# Altium project DATN_PCB_Project.PrjPCB
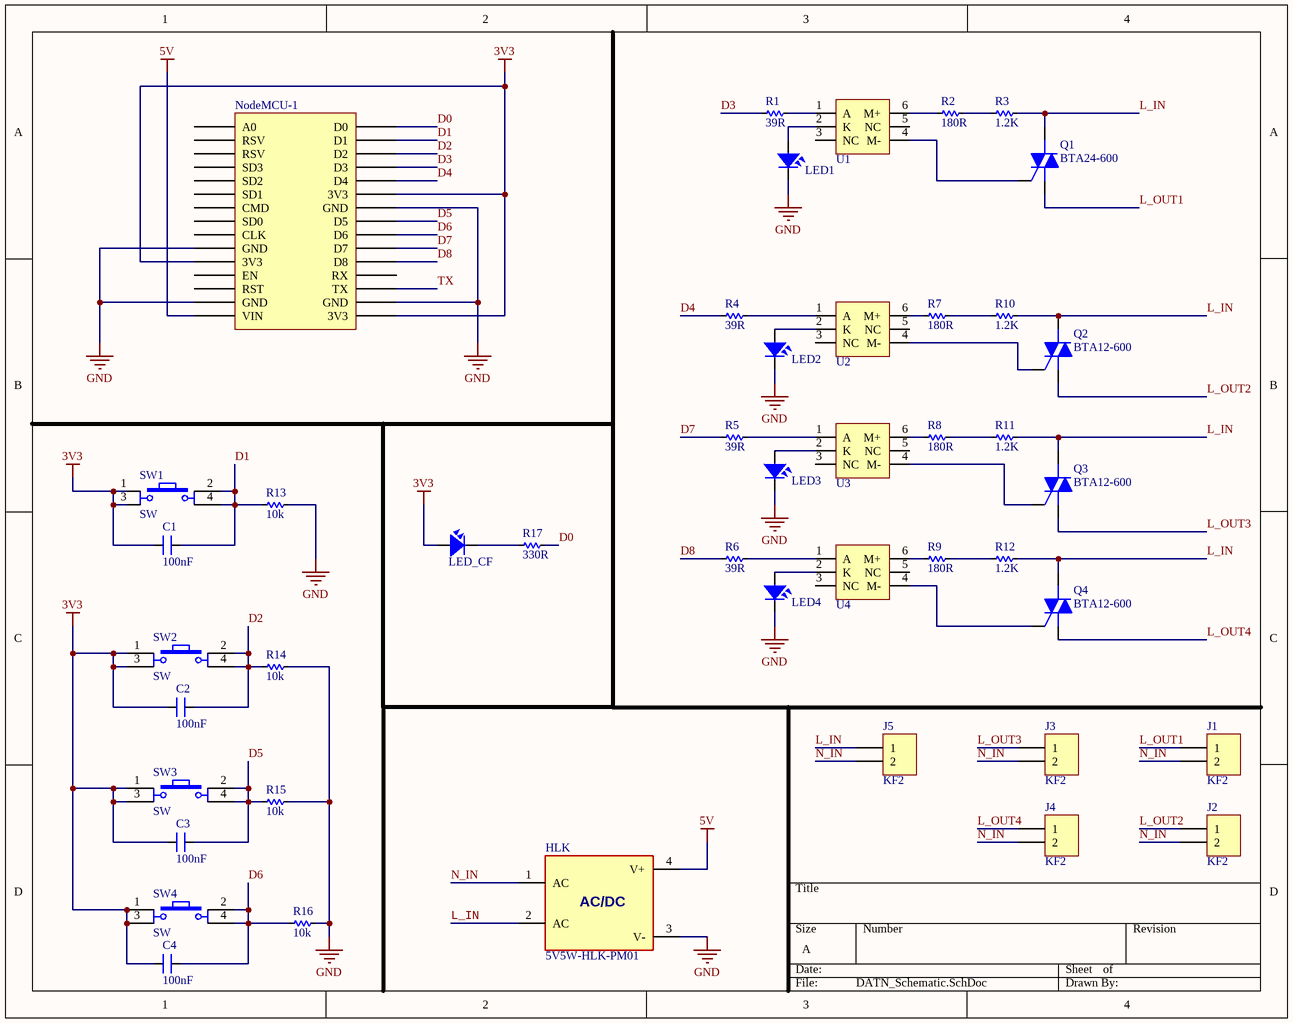
[diagram p0: DATN_Schematic.SchDoc]
1 sheet, 45 parts. Net scope: global (net labels, ports and power ports of the same name join across sheets).
Board file: PCB2.PcbDoc

## Sheet DATN_Schematic.SchDoc
size A

### Parts
C1  100nF  [CN1.5]
C2  100nF  [CN1.5]
C3  100nF  [CN1.5]
C4  100nF  [CN1.5]
HLK  5V5W-HLK-PM01  [HLK_PM01 5V3W]
J1  KF2  [KF2-5.08]
J2  KF2  [KF2-5.08]
J3  KF2  [KF2-5.08]
J4  KF2  [KF2-5.08]
J5  KF2  [KF2-5.08]
LED1  LED  [LED-5-RED]  (value not drawn)
LED2  LED  [LED-5-RED]  (value not drawn)
LED3  LED  [LED-5-RED]  (value not drawn)
LED4  LED  [LED-5-RED]  (value not drawn)
LED_CF  LED  [LED-5MM-BLUE]  (value not drawn)
NodeMCU-1  NodeMCU V1.0 ESP-12E  [NodeMCU V1.0 ESP-12E]  (value not drawn)
Q1  BTA24-600  [TO220H1]
Q2  BTA12-600  [TO220H1]
Q3  BTA12-600  [TO220H1]
Q4  BTA12-600  [TO220H1]
R1  39R  [RES-1/4W]
R2  180R  [RES-1/4W]
R3  1.2K  [RES-1/4W]
R4  39R  [RES-1/4W]
R5  39R  [RES-1/4W]
R6  39R  [RES-1/4W]
R7  180R  [RES-1/4W]
R8  180R  [RES-1/4W]
R9  180R  [RES-1/4W]
R10  1.2K  [RES-1/4W]
R11  1.2K  [RES-1/4W]
R12  1.2K  [RES-1/4W]
R13  10k  [RES-1/4W]
R14  10k  [RES-1/4W]
R15  10k  [RES-1/4W]
R16  10k  [RES-1/4W]
R17  330R  [RES-1/4W]
SW1  SW  [SW4B]
SW2  SW  [SW4B]
SW3  SW  [SW4B]
SW4  SW  [SW4B]
U1  MOC3021M  [DIP6]  (value not drawn)
U2  MOC3021M  [DIP6]  (value not drawn)
U3  MOC3021M  [DIP6]  (value not drawn)
U4  MOC3021M  [DIP6]  (value not drawn)

### Nets
3V3: C1.1 C2.1 C3.1 C4.1 LED_CF.1 NodeMCU-1.3V3 SW1.1 SW1.3 SW2.1 SW2.3 SW3.1 SW3.3 SW4.1 SW4.3
5V: HLK.4(V+) NodeMCU-1.VIN
GND: HLK.3(V-) LED1.2 LED2.2 LED3.2 LED4.2 NodeMCU-1.GND R13.2 R14.2 R15.2 R16.2
D0: NodeMCU-1.D0 R17.1
D1: C1.2 NodeMCU-1.D1 R13.1 SW1.2 SW1.4
D2: C2.2 NodeMCU-1.D2 R14.1 SW2.2 SW2.4
D3: NodeMCU-1.D3 R1.2
D4: NodeMCU-1.D4 R4.2
D5: C3.2 NodeMCU-1.D5 R15.1 SW3.2 SW3.4
D6: C4.2 NodeMCU-1.D6 R16.1 SW4.2 SW4.4
D7: NodeMCU-1.D7 R5.2
D8: NodeMCU-1.D8 R6.2
L_IN: HLK.2(AC) J5.1 Q1.2(M2) Q2.2(M2) Q3.2(M2) Q4.2(M2) R3.1 R10.1 R11.1 R12.1
L_OUT1: J1.1 Q1.1(M1)
L_OUT2: J2.1 Q2.1(M1)
L_OUT3: J3.1 Q3.1(M1)
L_OUT4: J4.1 Q4.1(M1)
N_IN: HLK.1(AC) J1.2 J2.2 J3.2 J4.2 J5.2
TX: NodeMCU-1.TX
NetLED1_1: LED1.1 U1.2(K)
NetLED2_1: LED2.1 U2.2(K)
NetLED3_1: LED3.1 U3.2(K)
NetLED4_1: LED4.1 U4.2(K)
NetLED_CF_2: LED_CF.2 R17.2
NetQ1_3: Q1.3(G) U1.4(M-)
NetQ2_3: Q2.3(G) U2.4(M-)
NetQ3_3: Q3.3(G) U3.4(M-)
NetQ4_3: Q4.3(G) U4.4(M-)
NetR1_1: R1.1 U1.1(A)
NetR2_1: R2.1 R3.2
NetR2_2: R2.2 U1.6(M+)
NetR4_1: R4.1 U2.1(A)
NetR5_1: R5.1 U3.1(A)
NetR6_1: R6.1 U4.1(A)
NetR7_1: R7.1 R10.2
NetR7_2: R7.2 U2.6(M+)
NetR8_1: R8.1 R11.2
NetR8_2: R8.2 U3.6(M+)
NetR9_1: R9.1 R12.2
NetR9_2: R9.2 U4.6(M+)

Not connected (* = marked no-connect by the designer): NodeMCU-1 A0 CLK CMD EN RST RSV RX SD0 SD1 SD2 SD3; U1 3(NC) 5(NC); U2 3(NC) 5(NC); U3 3(NC) 5(NC); U4 3(NC) 5(NC)

### Notes on the sheet
- (in symbol 5V3W-HLK-PM01) AC/DC

### Library data of the parts
C1-C4 = CN: Value: 33pF
HLK = 5V3W-HLK-PM01
J1-J5 = KF2: Manufacturer: Würth Elektronik eiSos GmbH; partNo: 691103110002; ComponentLink1 Description: Manufacturer; ComponentLink2 Description: Datasheet; NoPins: 2; Created Date: 29 October 2013; ComponentLink1URL: http://www.we-online.com; ComponentLink2URL: http://katalog.we-online.de/em/datasheet/6911031100xx.pdf; Created by: Karrer Zheng
LED1-LED4 LED_CF = LED: LED Single colour Green and Red; Value: LED 3 ly Single Colour
NodeMCU-1 = NodeMCU V1.0 ESP-12E: NodeMCU V1.0 ESP8266 (ESP-12E)
Q1-Q4 = BTA12-600: Silicon Bidirectional Triode Thyristor; Note: Pin 2 is electrically connected to Pin 4 (TAB); Published: 29-Sep-2000; LatestRevisionDate: 17-Jul-2002; LatestRevisionNote: Re-released for DXP Platform.; DatasheetDocument: 1999; PackageReference: 369-03; Publisher: Altium Limited; Code_JEDEC: TO-251-AA; ComponentLink1Description: Manufacturer Link; ComponentLink1URL: http://www.motorola.com/
R1-R17 = Res: Manufacturer: Generic Components; Class: Passive; SubClass: R; Published: 08/06/2000; Publisher: Altium Hobart Technology Centre
SW1-SW4 = SW4: Switch button 4 pin; Value: Button chip 4 pin